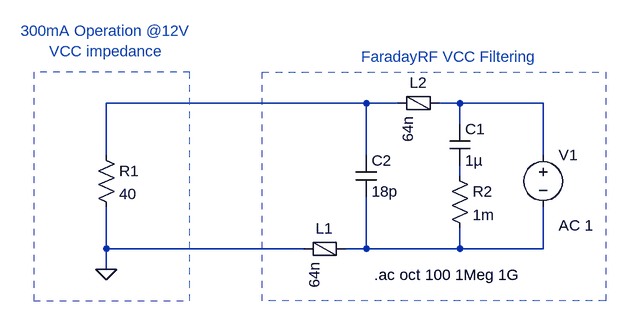
[diagram p0: schematic VCCFiltering.asc]
VCCFiltering.asc, the LTspice schematic file:
Version 4
SHEET 1 880 680
WIRE 0 192 -400 192
WIRE 48 192 0 192
WIRE 144 192 112 192
WIRE 272 192 144 192
WIRE 144 224 144 192
WIRE -400 272 -400 192
WIRE 0 272 0 192
WIRE 272 272 272 192
WIRE 144 304 144 288
WIRE -400 416 -400 352
WIRE -96 416 -400 416
WIRE 0 416 0 336
WIRE 0 416 -32 416
WIRE 144 416 144 384
WIRE 144 416 0 416
WIRE 272 416 272 352
WIRE 272 416 144 416
WIRE -400 448 -400 416
FLAG -400 448 0
SYMBOL voltage 272 256 R0
WINDOW 123 24 124 Left 2
WINDOW 39 0 0 Left 2
SYMATTR InstName V1
SYMATTR Value ""
SYMATTR Value2 AC 1
SYMBOL cap 128 224 R0
SYMATTR InstName C1
SYMATTR Value 1µ
SYMATTR SpiceLine Rser=10m
SYMBOL cap -16 272 R0
SYMATTR InstName C2
SYMATTR Value 18p
SYMATTR SpiceLine Rser=10m
SYMBOL FerriteBead 80 192 R90
WINDOW 0 -16 0 VBottom 2
SYMATTR InstName L2
SYMATTR Value 64n
SYMATTR SpiceLine Ipk=3 Rser=0.04 Rpar=56 Cpar=197f mfg="Wurth Elektronik" pn="742 792 112"
SYMBOL res -416 256 R0
SYMATTR InstName R1
SYMATTR Value 40
SYMBOL res 128 288 R0
SYMATTR InstName R2
SYMATTR Value 1m
SYMBOL FerriteBead -64 416 R90
WINDOW 0 -16 0 VBottom 2
SYMATTR InstName L1
SYMATTR Value 64n
SYMATTR SpiceLine Ipk=3 Rser=0.04 Rpar=56 Cpar=197f mfg="Wurth Elektronik" pn="742 792 112"
TEXT 12 456 Left 2 !.ac oct 100 1Meg 1G
TEXT -400 96 Center 2 ;300mA Operation @12V\nVCC impedance
TEXT -8 120 Left 2 ;FaradayRF VCC Filtering
RECTANGLE Normal 368 496 -160 144 2
RECTANGLE Normal -512 496 -272 144 2

The netlist it stands for:
* VCCFiltering.asc
V1 N002 N004 AC 1
C1 N002 N003 1µ Rser=10m
C2 N001 N004 18p Rser=10m
L2 N002 N001 64n Ipk=3 Rser=0.04 Rpar=56 Cpar=197f mfg="Wurth Elektronik" pn="742 792 112"
R1 N001 0 40
R2 N003 N004 1m
L1 N004 0 64n Ipk=3 Rser=0.04 Rpar=56 Cpar=197f mfg="Wurth Elektronik" pn="742 792 112"
.ac oct 100 1Meg 1G
* 300mA Operation @12V
* VCC impedance
* FaradayRF VCC Filtering
.backanno
.end